# Altium schematic sheet rf_lpf_30_20.SchDoc: mcHF Pro Transceiver RF board
size A3; Author: Krassi Atanassov; CompanyName: MØNKA; Engineer: For radio amateurs experimentation, non-commercial use only. Thank you!; Revision: 0.8.5; SheetTotal: 14
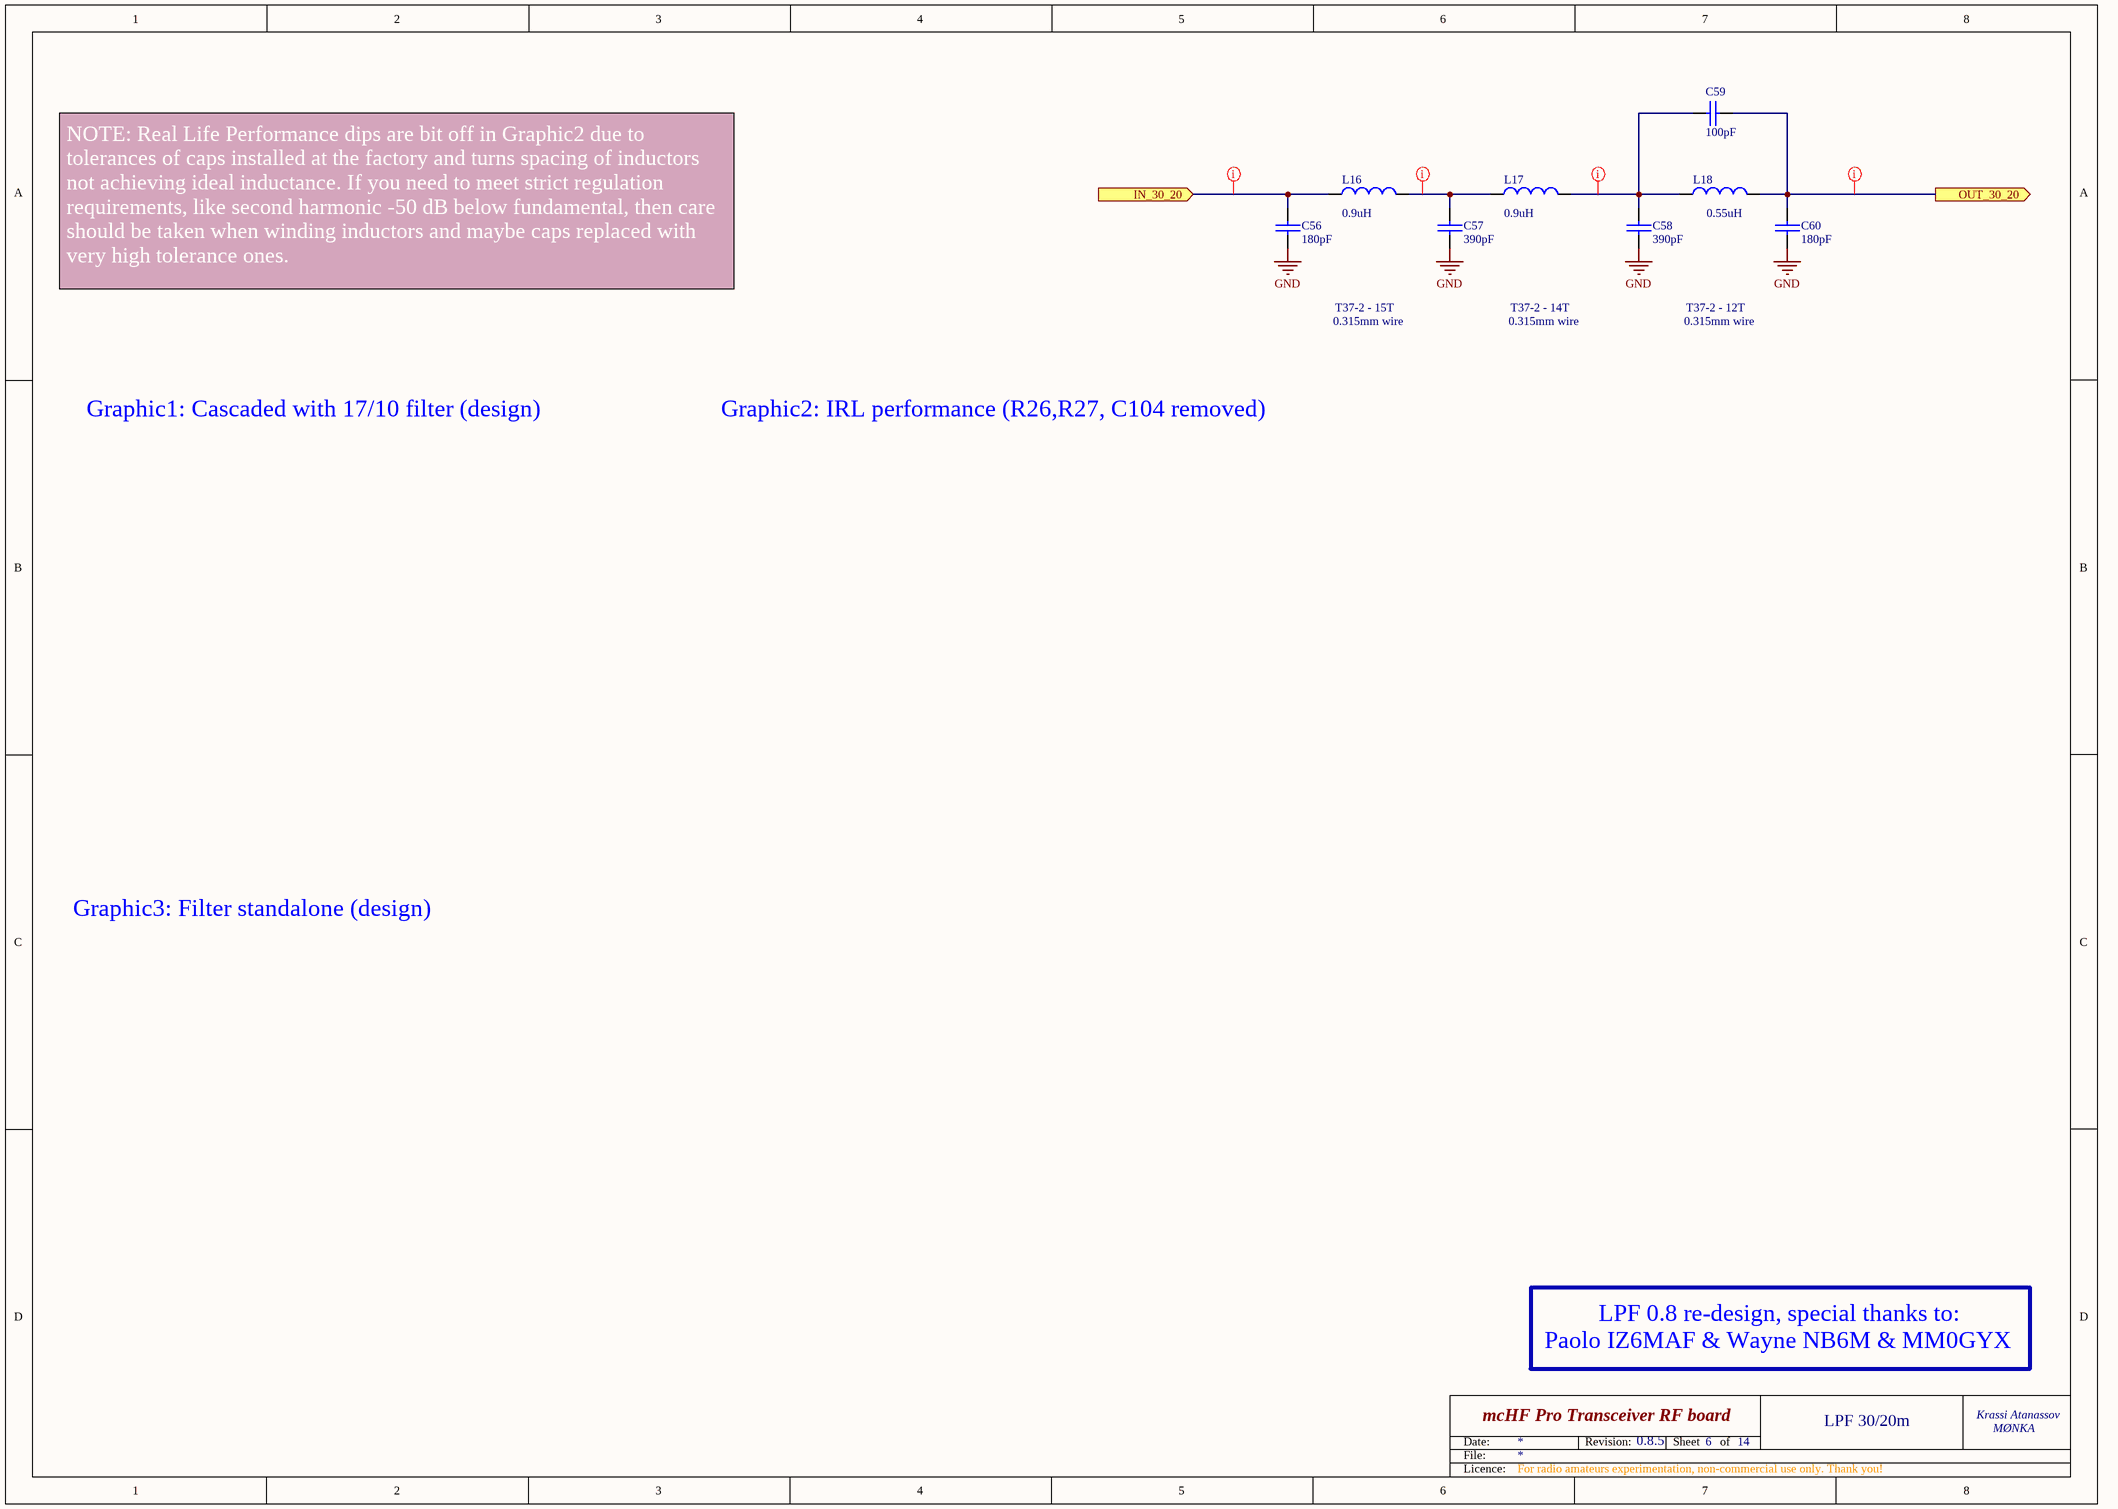
[diagram p0: rf_lpf_30_20.SchDoc]

## Parts
C56  180pF  [0805]
C57  390pF  [0805]
C58  390pF  [0805]
C59  100pF  [0805]
C60  180pF  [0805]
L16  Inductance: 0.9uH  [LPF_IND]  (hidden comment: T37-2)
L17  Inductance: 0.9uH  [LPF_IND]  (hidden comment: T37-2)
L18  Inductance: 0.55uH  [LPF_IND]  (hidden comment: T37-2)

## Ports
IN_30_20 (in), OUT_30_20 (out)

## Nets
GND: C56.1 C57.1 C58.1 C60.1
IN_30_20: C56.2 L16.1 ; port IN_30_20
OUT_30_20: C59.1 C60.2 L18.2 ; port OUT_30_20
NetC57_2: C57.2 L16.2 L17.1
NetC58_2: C58.2 C59.2 L17.2 L18.1

## Layout directives
rule Width Constraint [Pref Width = 30mil    Min Width = 30mil    Max Width = 30mil]: IN_30_20, NetC57_2, NetC58_2, OUT_30_20

## Notes on the sheet
- NOTE: Real Life Performance dips are bit off in Graphic2 due to tolerances of caps installed at the factory and turns spacing of inductors not achieving ideal inductance. If you need to meet strict regulation requirements, like second harmonic -50 dB below fundamental, then care should be taken when winding inductors and maybe caps replaced with very high tolerance ones.
- T37-2 - 15T
- T37-2 - 14T
- T37-2 - 12T
- 0.315mm wire
- Graphic1: Cascaded with 17/10 filter (design)
- Graphic2: IRL performance (R26,R27, C104 removed)
- Graphic3: Filter standalone (design)
- LPF 0.8 re-design, special thanks to:
- Paolo IZ6MAF & Wayne NB6M & MM0GYX
- 6
- LPF 30/20m
- Date:
- File:
- Revision:
- Sheet
- of
- Licence:

## Library data of the parts
C56-C60 = CAP: Capacitor; Notes: COG/NPO; Voltage: 100V
L16-L18 = LPF_IND: T37-2 handwound inductor; Notes: post assembly; Price: 0.20